# EAGLE design BEESP12 (EAGLE 6.5.0)
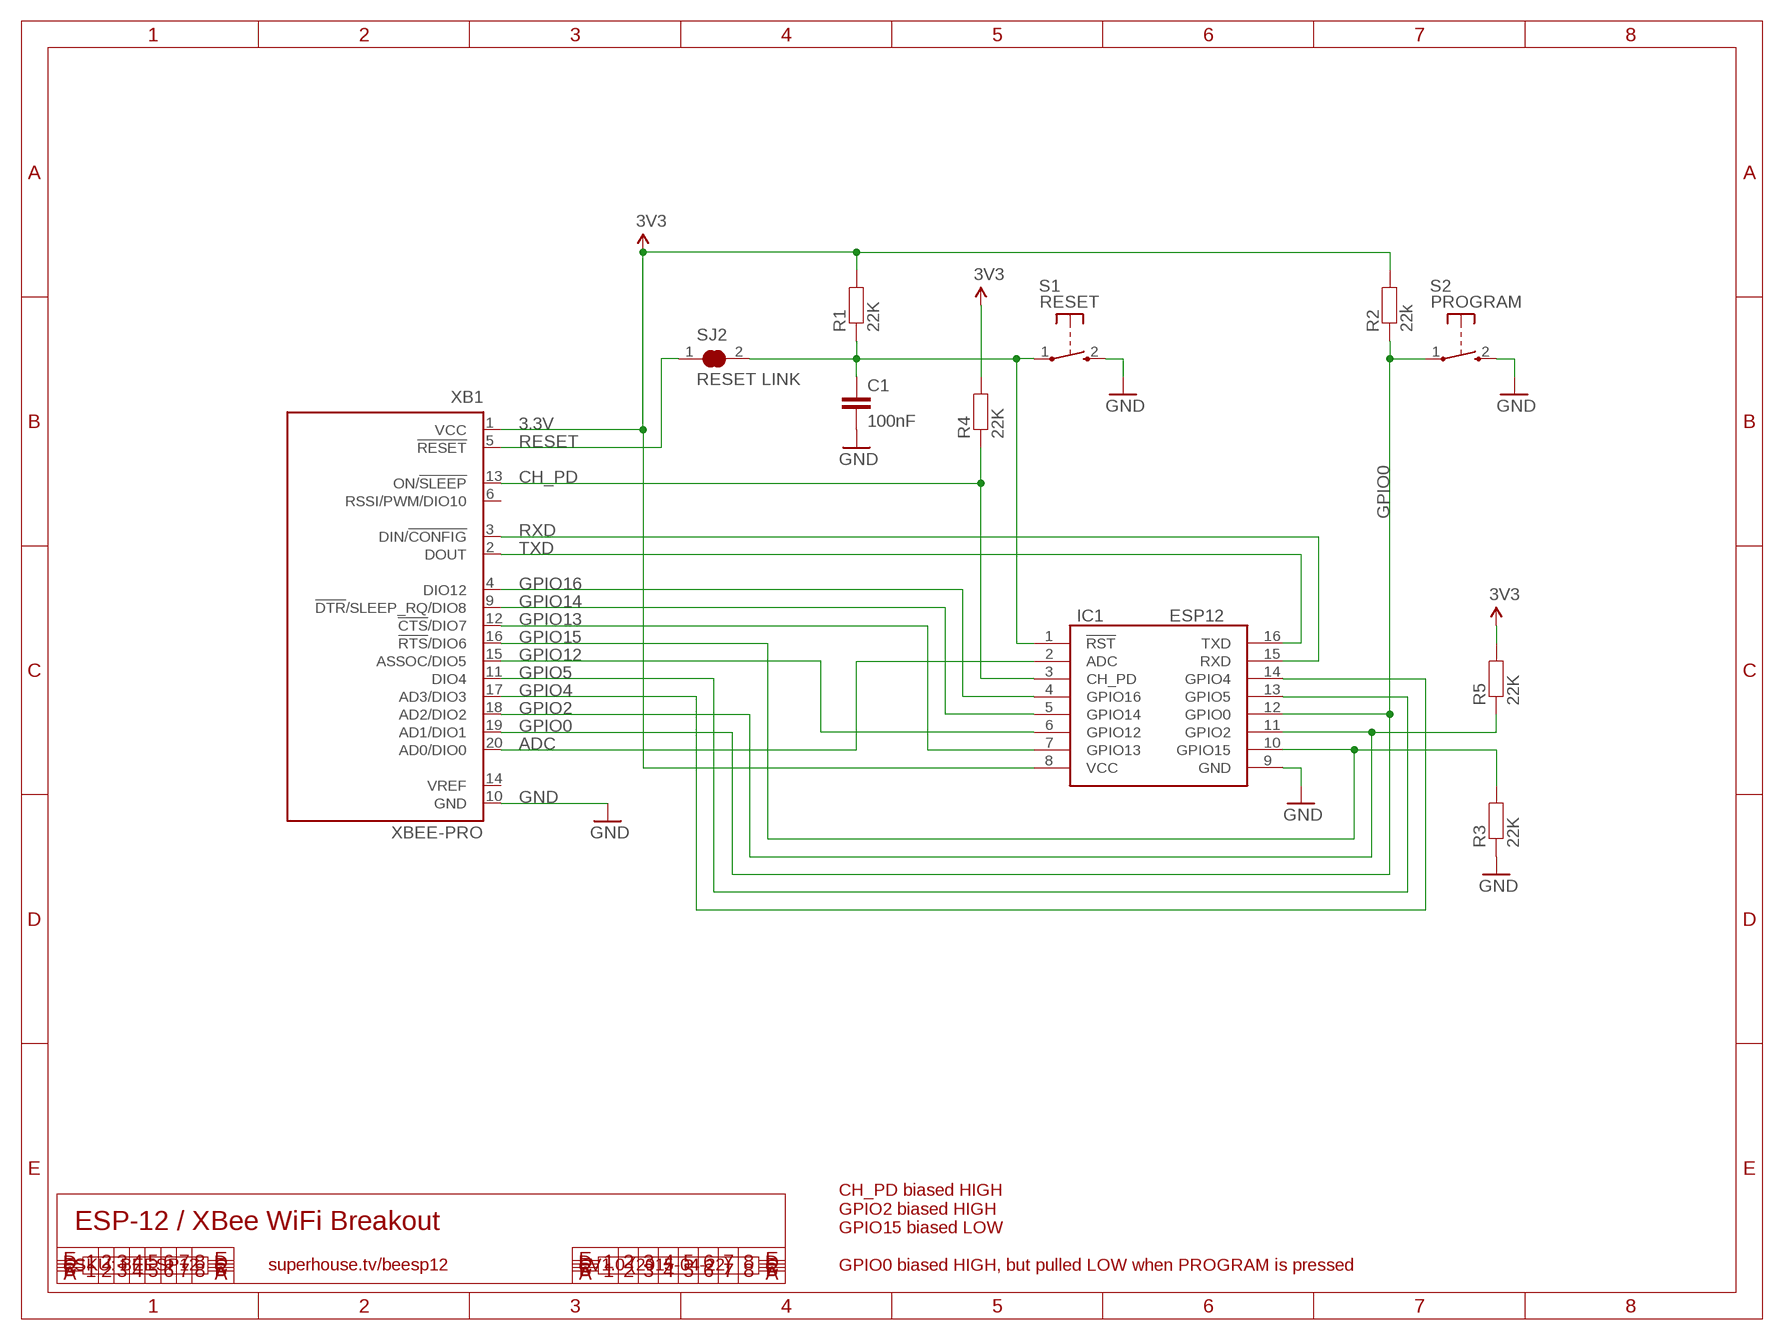
[diagram p0: schematic, sheet 1]

## Parts
C1  100nF  CAP0603  [0603]
IC1  ESP12  [ESP12]
R1  22K  RESISTOR0603  [0603]
R2  22k  RESISTOR0603  [0603]
R3  22K  RESISTOR0603  [0603]
R4  22K  RESISTOR0603  [0603]
R5  22K  RESISTOR0603  [0603]
S1  RESET  TAC_SWITCH_2PIN  [TACTILE_SWITCH_SMD_2PIN_TINY]
S2  PROGRAM  TAC_SWITCH_2PIN  [TACTILE_SWITCH_SMD_2PIN_TINY]
SJ2  RESET LINK  SJCN  [SJC]
XB1  XBEE-PRO  [XBEE-PRO]

## Nets
3.3V: IC1.8(VCC) R1.2 R2.2 R4.2 R5.2 XB1.1(VCC) ; supply symbol labelled 3V3
ADC: IC1.2(ADC) XB1.20(AD0/DIO0)
CH_PD: IC1.3(CH_PD) R4.1 XB1.13(ON/!SLEEP)
GND: C1.2 IC1.9(GND) R3.1 S1.2(S) S2.2(S) XB1.10(GND)
GPIO0: IC1.12(GPIO0) R2.1 S2.1(P) XB1.19(AD1/DIO1)
GPIO2: IC1.11(GPIO2) R5.1 XB1.18(AD2/DIO2)
GPIO4: IC1.14(GPIO4) XB1.17(AD3/DIO3)
GPIO5: IC1.13(GPIO5) XB1.11(DIO4)
GPIO12: IC1.6(GPIO12) XB1.15(ASSOC/DIO5)
GPIO13: IC1.7(GPIO13) XB1.12(!CTS!/DIO7)
GPIO14: IC1.5(GPIO14) XB1.9(!DTR!/SLEEP_RQ/DIO8)
GPIO15: IC1.10(GPIO15) R3.2 XB1.16(!RTS!/DIO6)
GPIO16: IC1.4(GPIO16) XB1.4(DIO12)
N$1: C1.1 IC1.1(!RST) R1.1 S1.1(P) SJ2.2
RESET: SJ2.1 XB1.5(!RESET)
RXD: IC1.15(RXD) XB1.3(DIN/!CONFIG)
TXD: IC1.16(TXD) XB1.2(DOUT)
Unconnected: XB1.6(RSSI/PWM/DIO10) XB1.14(VREF)

## Notes on the sheet
- ESP-12 / XBee WiFi Breakout
- SKU: BEESP12 | superhouse.tv/beesp12 | V1.0 (2015-04-22)
- CH_PD biased HIGH
  GPIO2 biased HIGH
  GPIO15 biased LOW
  
  GPIO0 biased HIGH, but pulled LOW when PROGRAM is pressed

## Library data of the parts
C1 = freetronics-master-v1.1:CAP: Capacitor Standard 0603 ceramic capacitor, and 0.1" leaded capacitor.
IC1 = freetronics-jon:ESP12
R1-R5 = freetronics-master-v1.1:RESISTOR: Resistor Basic schematic elements and footprints for 0603, 1206, and PTH 1/10th watt (small) resistors.
S1 S2 = freetronics-jon:TAC_SWITCH_2PIN: Momentary Tactile Switch - 2 pin
SJ2 = freetronics-jon:SJC
XB1 = freetronics-jon:XBEE: XBee (TM) /XBee-PRO(TM) OEM RF Modules Source: MaxStream, Inc. xbee_productmanual.pdf; MPN: XBP24-AWI-001; OC_FARNELL: 1337916; OC_NEWARK: 42M2667

## Net classes
0 Default: width 0.203 mm
1 VCC: width 0.305 mm

## Board
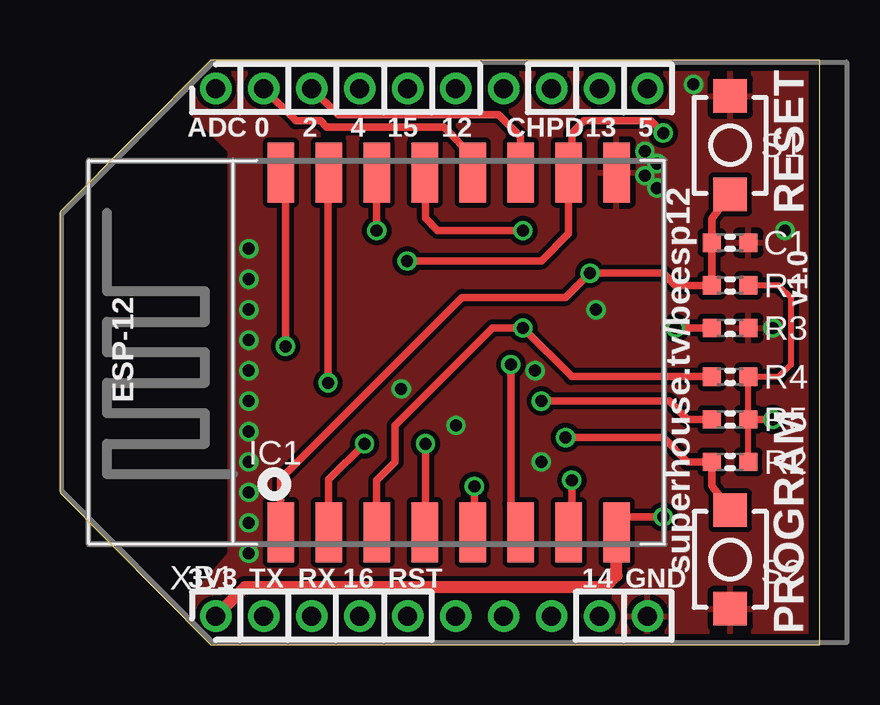
[diagram p1: board, top side]
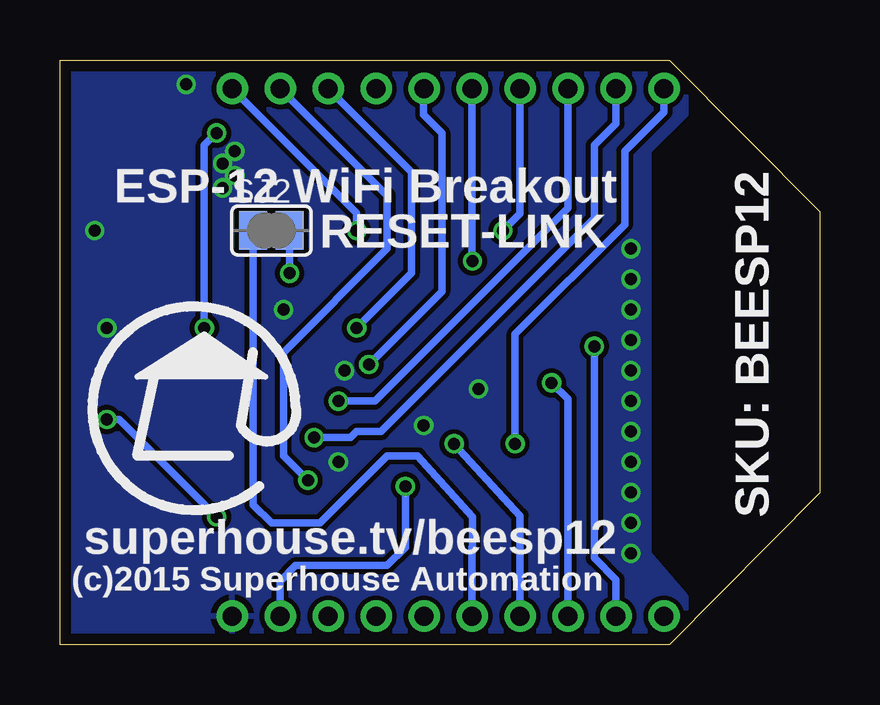
[diagram p2: board, bottom side, seen from below]

Size 31.67 x 24.38 mm. Coordinates in mm from the lower left corner, seen from the top.
Outline: 0,6.33 6.27,0 31.67,0 31.67,24.38 6.27,24.38 0,18.06 0,6.33
Copper layers (1*16): Top 0.035mm / dielectric 1.5mm / Bottom 0.035mm
Design rules "default": minimum track width 8mil, minimum drill 15mil, track to track 8mil, track to pad 8mil, pad to pad 8mil, via to via 8mil, smd to smd 8mil, copper to edge 18mil, drill to drill 8mil, minimum pad ring 10mil, minimum via ring 6mil, stop-mask expansion 4mil, vias tented up to drill 25mil, thermal gap 10mil

### Footprints (pad centres in the part's own frame; a part is rotated, then mirrored left to right if it is on the bottom)
0603 = smd 0.762 x 0.762: 1 -0.762,0; 2 0.762,0
ESP12 = smd 1.1 x 2.5: 1 -4,-7.5; 2 -2,-7.5; 3 0,-7.5; 4 2,-7.5; 5 4,-7.5; 6 6,-7.5; 7 8,-7.5; 8 10,-7.5; 9 10,7.5; 10 8,7.5; 11 6,7.5; 12 4,7.5; 13 2,7.5; 14 0,7.5; 15 -2,7.5; 16 -4,7.5
TACTILE_SWITCH_SMD_2PIN_TINY = smd 1.4 x 1.4: 1 -2.05,0; 2 2.05,0
SJC = smd 1.168 x 1.6: 1 -0.762,0; 2 0.762,0
XBEE-PRO = drill 0.8 pad 1.27: 1 -11,9; 2 -11,7; 3 -11,5; 4 -11,3; 5 -11,1; 6 -11,-1; 7 -11,-3; 8 -11,-5; 9 -11,-7; 10 -11,-9; 11 11,-9; 12 11,-7; 13 11,-5; 14 11,-3; 15 11,-1; 16 11,1; 17 11,3; 18 11,5; 19 11,7; 20 11,9

### Placement (x,y rotation side)
C1  27.94,16.76 0 top
IC1  13.21,12.19 0 top
R1  27.94,14.99 0 top
R2  27.94,7.62 0 top
R3  27.94,13.21 180 top
R4  27.94,11.18 0 top
R5  27.94,9.4 0 top
S1  27.94,20.83 90 top
S2  27.94,3.56 270 top
SJ2  22.86,17.27 0 bottom
XB1  15.49,12.19 90 top

### Tracks (layer width: path | path; a pad name or v marks a point on that pad's centre or on a via)
3.3V  (via drill 0.5)
  Top 0.254: R2.2 R5.2 R4.2 29.97,11.18 30.48,11.68 30.48,14.48 29.97,14.99 R1.2
  Top 0.305: IC1.8 23.37,4.85 23.37,5.33 v25.15,5.33 | v29.72,9.4 R5.2
  Top 0.508: XB1.1 7.71,2.41 22.73,2.41 23.21,2.89 IC1.8
  Bottom 0.305: v25.15,5.33 29.21,9.4 v29.72,9.4
ADC  (via drill 0.5)
  Top 0.305: v12.7,8.38 11.21,6.89 IC1.2
  Bottom 0.305: XB1.20 6.49,22.21 8.13,20.57 8.13,17.53 12.7,12.95 v12.7,8.38
CH_PD  (via drill 0.5)
  Top 0.305: R4.1 21.34,11.18 v19.3,13.21 18.03,13.21 13.97,9.14 13.97,7.62 13.21,6.86 IC1.3
  Bottom 0.305: v19.3,13.21 17.02,15.49 17.02,19.72 XB1.13
GND  (via drill 0.5)
  other vias: 7.87,11.43 29.72,13.21 22.35,13.97 24.89,20.07 24.38,20.57 24.38,19.56 7.87,12.7 7.87,13.97 7.87,15.24 7.87,16.51 7.87,10.16 7.87,8.89 7.87,7.62 16.51,9.14 14.22,10.67 24.89,19.05 30.23,17.27 26.42,23.37 19.81,11.43 20.07,7.62 7.87,6.35 7.87,5.08 7.87,3.81
  pour Bottom: 7.11,3.78 7.11,20.6 5.59,22.12 5.59,23.62 6.27,24.38 31.67,24.38 31.67,0 6.27,0 5.59,0.76 5.59,2.01
  pour Top: 7.11,3.78 7.11,20.6 5.59,22.12 5.59,23.62 6.27,24.38 31.67,24.38 31.67,0 6.27,0 5.59,0.76 5.59,2.01
GPIO0  (via drill 0.5)
  Top 0.254: IC1.12 17.21,20.38
  Top 0.305: 17.21,20.38 16,21.59 11.11,21.59 10.86,21.84 9.84,21.84 XB1.19 | S2.1 27.18,6.62 R2.1 26.16,7.62 25.15,8.64 v21.08,8.64
  Bottom 0.305: XB1.19 8.49,21.73 9.4,20.83 9.4,17.78 18.29,8.89 19.3,8.89 19.56,8.64 v21.08,8.64
GPIO2  (via drill 0.5)
  Top 0.305: XB1.18 11.59,22.1 18.29,22.1 19.21,21.18 IC1.11 | R5.1 26.16,9.4 25.4,10.16 v20.07,10.16
  Bottom 0.305: v20.07,10.16 18.54,10.16 10.49,18.21 XB1.18
GPIO4  (via drill 0.5)
  Top 0.305: IC1.14 v13.21,17.27
  Bottom 0.305: v13.21,17.27 12.49,17.99 XB1.17
GPIO5  (via drill 0.5)
  Top 0.305: IC1.13 15.24,19.66 15.24,17.78 15.75,17.27 v19.3,17.27
  Bottom 0.305: v19.3,17.27 19.3,18 XB1.11
GPIO12  (via drill 0.5)
  Top 0.254: 19.3,4.79 IC1.6 18.8,5.87
  Top 0.305: v18.8,11.68 18.8,5.87
  Bottom 0.305: XB1.15 16.51,23.18 16.51,22.1 15.75,21.34 15.75,14.73 v18.8,11.68
GPIO13  (via drill 0.5)
  Top 0.305: IC1.7 21.34,4.82 v21.34,6.86
  Bottom 0.305: v21.34,6.86 22.35,7.87 22.35,12.19 18.03,16.51 18.03,18.73 XB1.12
GPIO14  (via drill 0.5)
  Top 0.305: v17.27,6.6 17.27,4.76 IC1.5
  Bottom 0.305: XB1.9 22.49,2.65 21.84,3.3 18.03,3.3 17.27,4.06 v17.27,6.6
GPIO15  (via drill 0.5)
  Top 0.305: v14.48,16 20.07,16 21.21,17.14 IC1.10 21.34,19.82 21.34,21.34 21.84,21.84 24.64,21.84 v25.15,21.34 | R3.2 v25.65,13.21
  Bottom 0.305: XB1.16 14.49,15.76 v14.48,16 | v25.65,13.21 25.65,20.83 v25.15,21.34
GPIO16  (via drill 0.5)
  Top 0.305: v15.24,8.38 15.24,4.72 IC1.4
  Bottom 0.305: XB1.4 12.49,5.38 v15.24,8.38
N$1  (via drill 0.5)
  Top 0.305: S1.1 27.18,17.76 C1.1 R1.1 25.65,14.99 25.15,15.49 v22.1,15.49 21.08,14.48 16.76,14.48 9.21,6.92 IC1.1
  Bottom 0.305: v22.1,15.49 SJ2.2
RESET
  Bottom 0.305: XB1.5 14.49,4.08 14.48,4.06 14.48,5.33 16.76,7.87 18.03,7.87 20.83,5.08 22.86,5.08 23.62,5.84 SJ2.1
RXD  (via drill 0.5)
  Top 0.254: IC1.15 11.18,19.66
  Top 0.305: 11.18,19.66 v11.18,10.92
  Bottom 0.305: v11.18,10.92 10.49,10.24 XB1.3
TXD  (via drill 0.5)
  Top 0.254: IC1.16 9.14,19.63
  Top 0.305: v9.4,12.45 9.4,19.5 IC1.16
  Bottom 0.305: v9.4,12.45 9.4,3.62 8.49,2.72 XB1.2

### Text on the board
tPlace: ADC | 0 | 2 | 4 | 15 | 12 | CHPD | 13 | 5 | RESET | v1.0 | ESP-12 | superhouse.tv/beesp12 | 3V3 | TX | RX | 16 | RST | 14 | GND | PROGRAM
bPlace: SKU: BEESP12 | ESP-12 WiFi Breakout | RESET-LINK | superhouse.tv/beesp12 | (c)2015 Superhouse Automation
tNames: S1 | S2